# EAGLE design untitled (EAGLE 9.6.2)
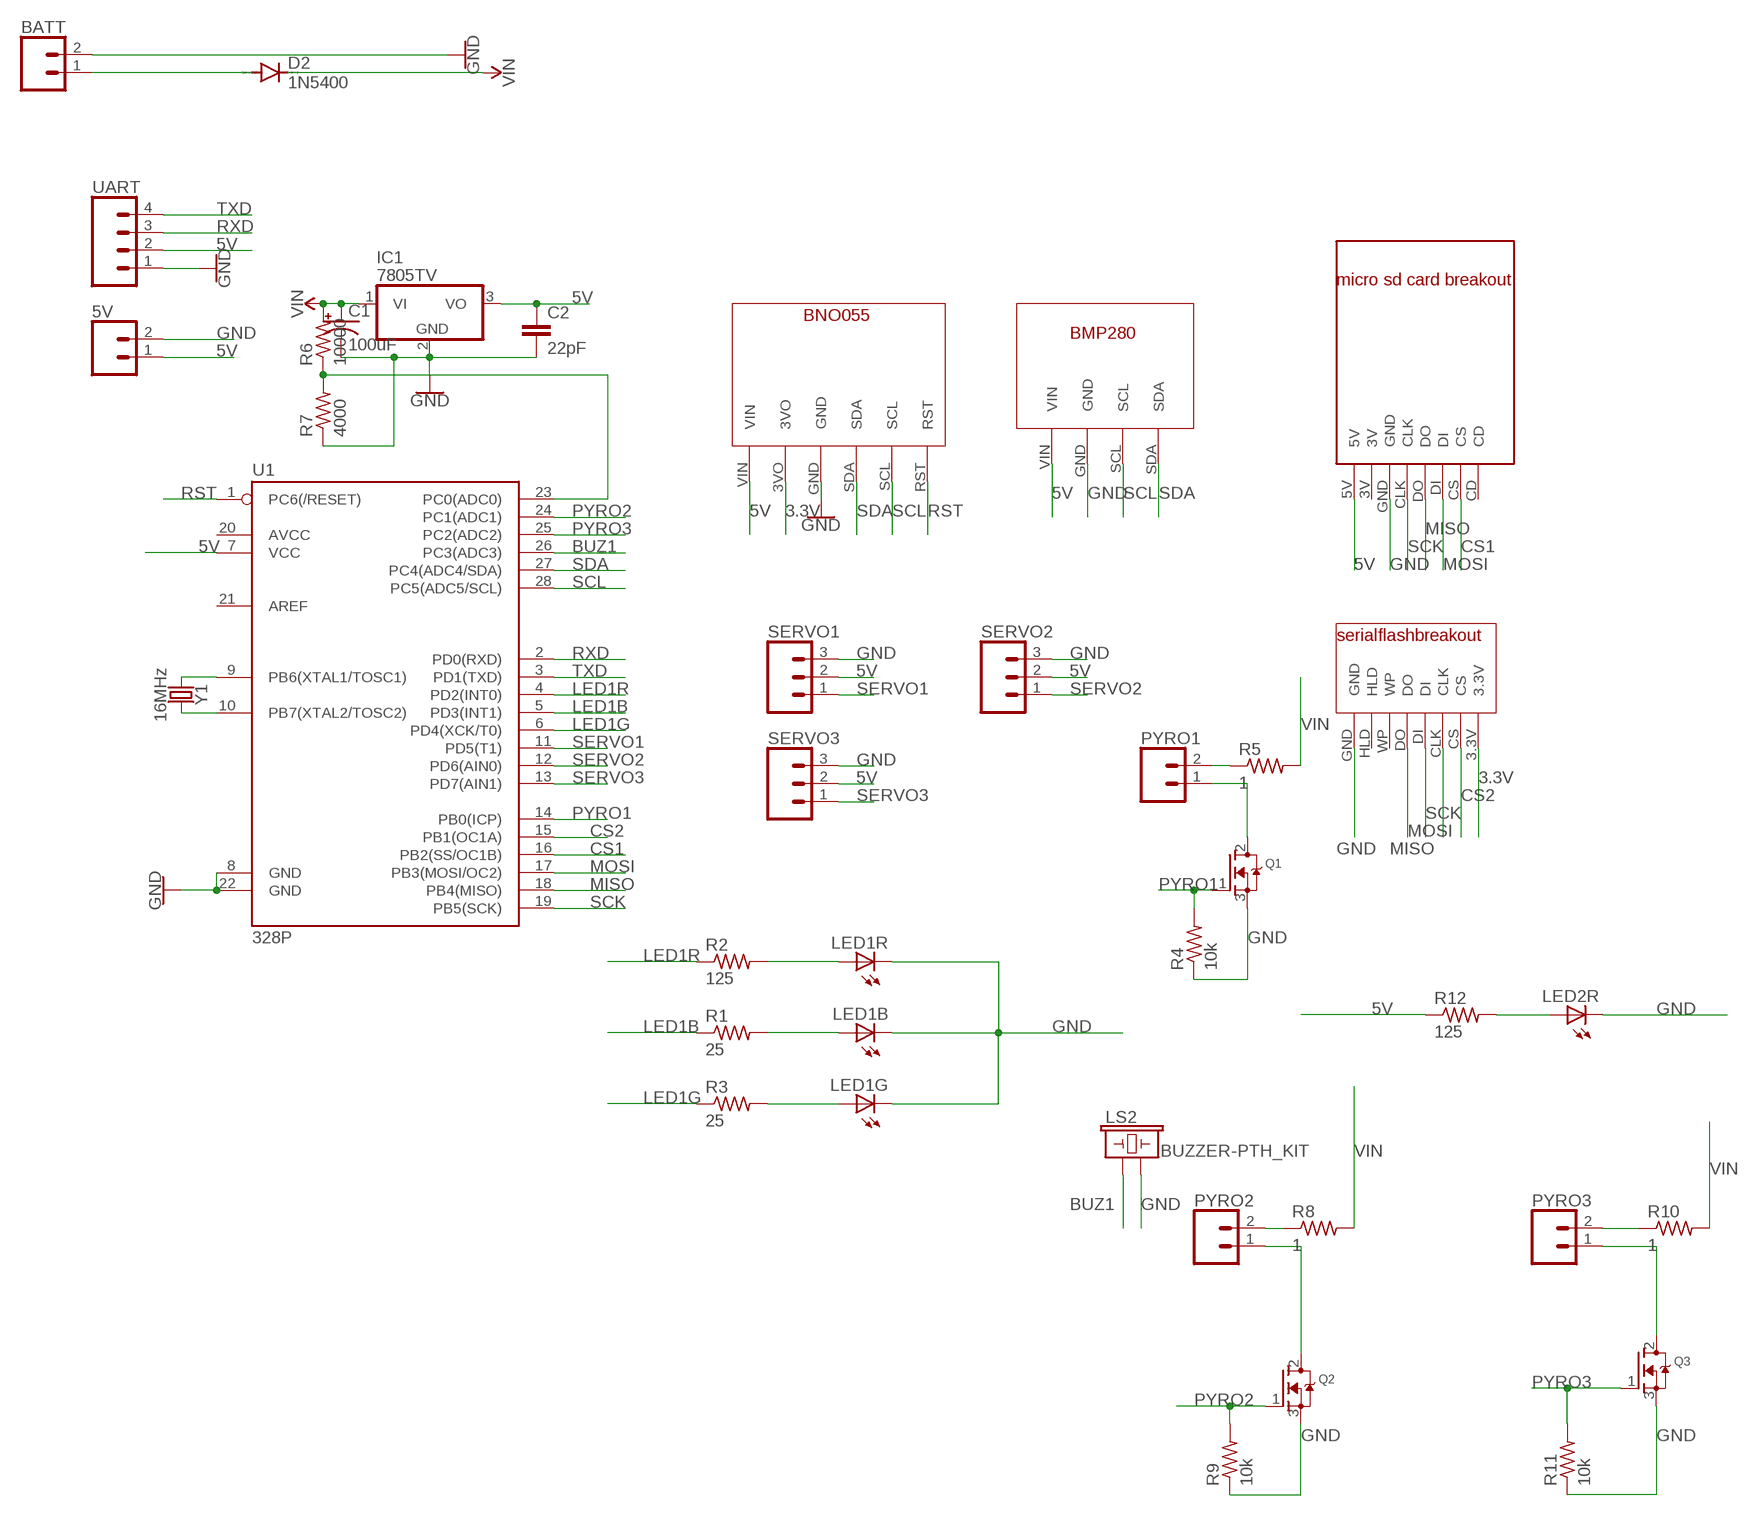
[diagram p0: schematic, sheet 1]

## Parts
5V  CONN_02  [1X02]
BATT  CONN_02  [1X02]
C1  100uF  100UF-POLAR-RADIAL-2.5MM-25V-20%  [CPOL-RADIAL-2.5MM-6.5MM]
C2  22pF  22PF-PTH-2.54MM-200V-5%  [CAP-PTH-2.54]
D2  1N5400  [DO201-15]
IC1  7805TV  [TO220V]
LED1B  LED1B  LED5MM  [LED5MM]
LED1G  LED1G  LED5MM  [LED5MM]
LED1R  LED1R  LED5MM  [LED5MM]
LED2R  LED1R  LED5MM  [LED5MM]
LS2  BUZZER-PTH_KIT  [BUZZER-12MM-KIT]
PYRO1  CONN_02  [1X02]
PYRO2  CONN_02  [1X02]
PYRO3  CONN_02  [1X02]
Q1  MOSFET-NGDS_TO220V  [TO220V]
Q2  MOSFET-NGDS_TO220V  [TO220V]
Q3  MOSFET-NGDS_TO220V  [TO220V]
R1  25  FLIPFLOP-RES  [0805-THM]
R2  125  FLIPFLOP-RES  [0805-THM]
R3  25  FLIPFLOP-RES  [0805-THM]
R4  10k  FLIPFLOP-RES  [0805-THM]
R5  1  FLIPFLOP-RES  [0805-THM]
R6  10000  FLIPFLOP-RES  [0805-THM]
R7  4000  FLIPFLOP-RES  [0805-THM]
R8  1  FLIPFLOP-RES  [0805-THM]
R9  10k  FLIPFLOP-RES  [0805-THM]
R10  1  FLIPFLOP-RES  [0805-THM]
R11  10k  FLIPFLOP-RES  [0805-THM]
R12  125  FLIPFLOP-RES  [0805-THM]
SERVO1  CONN_03  [1X03]
SERVO2  CONN_03  [1X03]
SERVO3  CONN_03  [1X03]
U1  328P  ATMEGA328P_PDIP  [DIP28]
U$1  BNO055  [BNO055]
U$2  BMP280  [BMP280]
U$3  ADAFRUITSDCARD  [ADAFRUITSDCARD]
U$4  SPARKFUNFLASHBREAKOUT  [SPARKFUNFLASHBREAKOUT]
UART  CONN_04PTH  [1X04]
Y1  16MHz  CRYSTAL-16MHZPTH-HC49US  [HC49US]

## Nets
3.3V: U$1.3VO U$4.3.3V
5V: 5V.1 C2.1 IC1.3(VO) R12.1 SERVO1.2 SERVO2.2 SERVO3.2 U1.7(VCC) U$1.VIN U$2.VIN U$3.5V UART.2
BUZ1: LS2.+ U1.26(PC3(ADC3))
CS1: U1.16(PB2(SS/OC1B)) U$3.CS
CS2: U1.15(PB1(OC1A)) U$4.CS
GND: 5V.2 BATT.2 C1.2(-) C2.2 IC1.2(GND) LED1B.K(C) LED1G.K(C) LED1R.K(C) LED2R.K(C) LS2.- Q1.3(S) Q2.3(S) Q3.3(S) R4.1 R7.1 R9.1 R11.1 SERVO1.3 SERVO2.3 SERVO3.3 U1.8(GND) U1.22(GND) U$1.GND U$2.GND U$3.GND U$4.GND UART.1
LED1B: R1.1 U1.5(PD3(INT1))
LED1G: R3.1 U1.6(PD4(XCK/T0))
LED1R: R2.1 U1.4(PD2(INT0))
MISO: U1.18(PB4(MISO)) U$3.DO U$4.DO
MOSI: U1.17(PB3(MOSI/OC2)) U$3.DI U$4.DI
N$1: PYRO1.1 Q1.2(D)
N$2: LED1R.A R2.2
N$3: LED1B.A R1.2
N$4: LED1G.A R3.2
N$5: PYRO1.2 R5.1
N$6: R6.1 R7.2 U1.23(PC0(ADC0))
N$7: U1.9(PB6(XTAL1/TOSC1)) Y1.1
N$8: U1.10(PB7(XTAL2/TOSC2)) Y1.2
N$9: BATT.1 D2.A
N$10: PYRO2.2 R8.1
N$11: PYRO3.2 R10.1
N$12: PYRO2.1 Q2.2(D)
N$13: PYRO3.1 Q3.2(D)
N$14: LED2R.A R12.2
PYRO1: Q1.1(G) R4.2 U1.14(PB0(ICP))
PYRO2: Q2.1(G) R9.2 U1.24(PC1(ADC1))
PYRO3: Q3.1(G) R11.2 U1.25(PC2(ADC2))
RST: U1.1(PC6(/RESET)) U$1.RST
RXD: U1.2(PD0(RXD)) UART.3
SCK: U1.19(PB5(SCK)) U$3.CLK U$4.CLK
SCL: U1.28(PC5(ADC5/SCL)) U$1.SCL U$2.SCL
SDA: U1.27(PC4(ADC4/SDA)) U$1.SDA U$2.SDA
SERVO1: SERVO1.1 U1.11(PD5(T1))
SERVO2: SERVO2.1 U1.12(PD6(AIN0))
SERVO3: SERVO3.1 U1.13(PD7(AIN1))
TXD: U1.3(PD1(TXD)) UART.4
VIN: C1.1(+) D2.C IC1.1(VI) R5.2 R6.2 R8.2 R10.2
Unconnected: U1.20(AVCC) U1.21(AREF) U$3.3V U$3.CD U$4.HLD U$4.WP

## Library data of the parts
5V BATT PYRO1-PYRO3 = SparkFun-Connectors:CONN_02: Multi connection point. Often used as Generic Header-pin footprint for 0.1 inch spaced/style header connections On any of the 0.1 inch spaced packages, you can populate with these: Break Away Headers - Straight <https://www.sparkfun.com/products/116> (PRT-00116) Break Away Male Headers - Right Angle <https://www.sparkfun.com/products/553> (PRT-00553) Female Headers <https://www.sparkfun.com/products/115> (PRT-00115) Break Away Headers - Machine Pin <https://www.sparkfun.com/products/117> (PRT-00117) Break Away Female Headers - Swiss Machine Pin <https://www.sparkfun.com/products/743> (PRT-00743) For SCREWTERMINALS and SPRING TERMINALS visit here: Screw Terimnals on SparkFun.com <https://www.sparkfun.com/search/results?term=Screw+Terminals> (5mm/3.5mm/2.54mm spacing) This device is also useful as a general connection point to wire up your design to another part of your project. Our various solder wires solder well into these plated through hole pads. Hook-Up Wire - Assortment (Stranded, 22 AWG) <https://www.sparkfun.com/products/11375> (PRT-11375) Hook-Up Wire - Assortment (Solid Core, 22 AWG) <https://www.sparkfun.com/products/11367> (PRT-11367) View the entire wire category on our website here <https://www.sparkfun.com/categories/141> Special notes: Molex polarized connector foot print use with: PRT-08233 with associated crimp pins and housings. 2.54_SCREWTERM for use with PRT-10571. 3.5mm Screw Terminal footprints for PRT-08084 5mm Screw Terminal footprints for use with PRT-08432
C1 = SparkFun-Capacitors:100UF-POLAR: 100µF polarized capacitors A capacitor is a passive two-terminal electrical component used to store electrical energy temporarily in an electric field.; PROD_ID: CAP-08439
C2 = SparkFun-Capacitors:22PF: 22pF ceramic capacitors A capacitor is a passive two-terminal electrical component used to store electrical energy temporarily in an electric field.; PROD_ID: CAP-09128
D2 = diode:1N5400: DIODE standard rectifier, 3 A, 50 V (Motorola)
IC1 = linear:78*: Positive VOLTAGE REGULATOR Source: http://cache.national.com/ds/LM/LM78L05.pdf http://www.fairchildsemi.com/ds/LM/LM7805.pdf
LED1B LED1G LED1R LED2R = adafruit:LED: LED OSRAM: - CHIPLED LG R971, LG N971, LY N971, LG Q971, LY Q971, LO R971, LY R971 LH N974, LH R974 LS Q976, LO Q976, LY Q976 LO Q996 - Hyper CHIPLED LW Q18S LB Q993, LB Q99A, LB R99A - SideLED LS A670, LO A670, LY A670, LG A670, LP A670 LB A673, LV A673, LT A673, LW A673 LH A674 LY A675 LS A676, LA A676, LO A676, LY A676, LW A676 LS A679, LY A679, LG A679 - Hyper Micro SIDELED® LS Y876, LA Y876, LO Y876, LY Y876 LT Y87S - SmartLED LW L88C, LW L88S LB L89C, LB L89S, LG L890 LS L89K, LO L89K, LY L89K LS L896, LA L896, LO L896, LY L896 - TOPLED LS T670, LO T670, LY T670, LG T670, LP T670 LSG T670, LSP T670, LSY T670, LOP T670, LYG T670 LG T671, LOG T671, LSG T671 LB T673, LV T673, LT T673, LW T673 LH T674 LS T676, LA T676, LO T676, LY T676, LB T676, LH T676, LSB T676, LW T676 LB T67C, LV T67C, LT T67C, LS T67K, LO T67K, LY T67K, LW E67C LS E67B, LA E67B, LO E67B, LY E67B, LB E67C, LV E67C, LT E67C LW T67C LS T679, LY T679, LG T679 LS T770, LO T770, LY T770, LG T770, LP T770 LB T773, LV T773, LT T773, LW T773 LH T774 LS E675, LA E675, LY E675, LS T675 LS T776, LA T776, LO T776, LY T776, LB T776 LHGB T686 LT T68C, LB T68C - Hyper Mini TOPLED® LB M676 - Mini TOPLED Santana® LG M470 LS M47K, LO M47K, LY M47K Source: http://www.osram.convergy.de/
LS2 = SparkFun-Electromechanical:BUZZER: Buzzer Small round buzzers that operate around the audible 2kHz range. You can use these as speakers to create simple music or user interfaces. Variant Overview: PTH - Mini Speaker - PC Mount 12mm 2.048kHz <https://www.sparkfun.com/products/7950> PTH_KIT - Mini Speaker - PC Mount 12mm 2.048kHz <https://www.sparkfun.com/products/7950> KIT simplifies soldering by adding stop mask to one side of the pads. PTH_NO_SILK - Mini Speaker - PC Mount 12mm 2.048kHz <https://www.sparkfun.com/products/7950> No silkscreen indicator of buzzer outline. PTH_KIT_NO_SILK - Mini Speaker - PC Mount 12mm 2.048kHz <https://www.sparkfun.com/products/7950> KIT package w/o silkscreen SMD - Buzzer Audio Magnetic (CCV-084B16) SMD buzzer used on, e.g. the LilyPad Buzzer <https://www.sparkfun.com/products/8463> and RFID USB Reader <https://www.sparkfun.com/products/9963>. SMD_KIT - Buzzer Audio Magnetic (CCV-084B16) SMD Buzzer with elongated pins to make soldering easier. Used on the SparkFun Simon Says - Surface Mount Soldering Kit <https://www.sparkfun.com/products/10935>. SMD-SQUARE - Buzzer Audio Magnetic (COMP-15701) SMT square buzzer with one chamfered corner.; PROD_ID: COMP-08253; SF_SKU: COM-07950
Q1-Q3 = adafruit:MOSFET-N: N-Channel Mosfet 2N7002E - 60V 260mA SOT23 [Digikey: 2N7002ET1GOSTR-ND] - REEL BSH103 - 30V 850mA SOT23 [Digikey: 568-5013-1-ND]
R1-R12 = adafruit:FLIPFLOP-RES: Flip Flop resistor An 0805 resistor inside a standard 1/4W 5% resistor. Makes for easy mods
SERVO1-SERVO3 = SparkFun-Connectors:CONN_03: Multi connection point. Often used as Generic Header-pin footprint for 0.1 inch spaced/style header connections On any of the 0.1 inch spaced packages, you can populate with these: Break Away Headers - Straight <https://www.sparkfun.com/products/116> (PRT-00116) Break Away Male Headers - Right Angle <https://www.sparkfun.com/products/553> (PRT-00553) Female Headers <https://www.sparkfun.com/products/115> (PRT-00115) Break Away Headers - Machine Pin <https://www.sparkfun.com/products/117> (PRT-00117) Break Away Female Headers - Swiss Machine Pin <https://www.sparkfun.com/products/743> (PRT-00743) Stackable Header - 3 Pin (Female, 0.1") <https://www.sparkfun.com/products/13875> (PRT-13875) For SCREWTERMINALS and SPRING TERMINALS visit here: Screw Terimnals on SparkFun.com <https://www.sparkfun.com/search/results?term=Screw+Terminals> (5mm/3.5mm/2.54mm spacing) This device is also useful as a general connection point to wire up your design to another part of your project. Our various solder wires solder well into these plated through hole pads. Hook-Up Wire - Assortment (Stranded, 22 AWG) <https://www.sparkfun.com/products/11375> (PRT-11375) Hook-Up Wire - Assortment (Solid Core, 22 AWG) <https://www.sparkfun.com/products/11367> (PRT-11367) View the entire wire category on our website here <https://www.sparkfun.com/categories/141> Special notes: Molex polarized connector foot print use with SKU : PRT-08232 with associated crimp pins and housings.
U1 = SparkFun-IC-Microcontroller:ATMEGA328P_PDIP: Atmel 328P Through hole ATMEGA328P uC used in the Arduino 32kb flash, 1k EEPROM, 2k SRAM Datasheet <http://www.sparkfun.com/datasheets/Components/SMD/ATMega328.pdf> SparkFun Products Storefront component: AVR 28 Pin 20MHz 32K 6A/D - ATMega328P <https://www.sparkfun.com/products/9061> (COM-09061) SparkFun Simon Says - Through-Hole Soldering Kit <https://www.sparkfun.com/products/10547> (KIT-10547) SparkFun Learn to Solder - Simon Says <https://www.sparkfun.com/products/13708> (KIT-13708) SparkFun BigTime Watch Kit <https://www.sparkfun.com/products/11734> (KIT-11734) SparkFun ClockIt <https://www.sparkfun.com/products/10930> (KIT-10930) SparkFun Serial Enabled LCD Kit <https://www.sparkfun.com/products/10097> (LCD-10097) SparkFun Simon Tilts - Through Hole Soldering Kit <https://www.sparkfun.com/products/12634> (KIT-12634) SparkFun Frequency Counter Kit <https://www.sparkfun.com/products/10140> (KIT-10140) FabFM Radio Kit <https://www.sparkfun.com/products/11043> (KIT-11043) SparkFun Binary Blaster Kit <https://www.sparkfun.com/products/12037> (KIT-12037) SparkFun Metro-Gnome <https://www.sparkfun.com/products/9236> (KIT-09236) ATmega328 with Arduino Optiboot (Uno) <https://www.sparkfun.com/products/10524> (DEV-10524); PROD_ID: IC-09136
U$1 = BNO055:BNO055
U$2 = bmp280:BMP280
U$3 = micro sd card breakout:ADAFRUITSDCARD
U$4 = SPARKFUNFLASHBREAKOUT:SPARKFUNFLASHBREAKOUT
UART = SparkFun-Connectors:CONN_04: Multi connection point. Often used as Generic Header-pin footprint for 0.1 inch spaced/style header connections On any of the 0.1 inch spaced packages, you can populate with these: Break Away Headers - Straight <https://www.sparkfun.com/products/116> (PRT-00116) Break Away Male Headers - Right Angle <https://www.sparkfun.com/products/553> (PRT-00553) Female Headers <https://www.sparkfun.com/products/115> (PRT-00115) Break Away Headers - Machine Pin <https://www.sparkfun.com/products/117> (PRT-00117) Break Away Female Headers - Swiss Machine Pin <https://www.sparkfun.com/products/743> (PRT-00743) For SCREWTERMINALS and SPRING TERMINALS visit here: Screw Terimnals on SparkFun.com <https://www.sparkfun.com/search/results?term=Screw+Terminals> (5mm/3.5mm/2.54mm spacing) This device is also useful as a general connection point to wire up your design to another part of your project. Our various solder wires solder well into these plated through hole pads. Hook-Up Wire - Assortment (Stranded, 22 AWG) <https://www.sparkfun.com/products/11375> (PRT-11375) Hook-Up Wire - Assortment (Solid Core, 22 AWG) <https://www.sparkfun.com/products/11367> (PRT-11367) View the entire wire category on our website here <https://www.sparkfun.com/categories/141> Special notes: Molex polarized connector foot print use with SKU : PRT-08231 with associated crimp pins and housings. 1MM SMD Version SKU: PRT-10208; PROD_ID: CONN-09696
Y1 = SparkFun-Clocks:CRYSTAL-16MHZ: 16MHz Crystal Digikey Example <http://www.digikey.com/product-search/en?keywords=535-9122-1-ND> Frequency: 16MHz Frequency Stability: ±50ppm Frequency Tolerance: ±20ppm Load Capacitance: 18pF SparkFun Products: Pro Micro -5V/16MHz <https://www.sparkfun.com/products/12640> SparkFun Serial Enabled LCD Kit <https://www.sparkfun.com/products/10097>; PROD_ID: XTAL-08181; SF_ID: COM-00536

## Net classes
0 default: width 0.75 mm

## Board
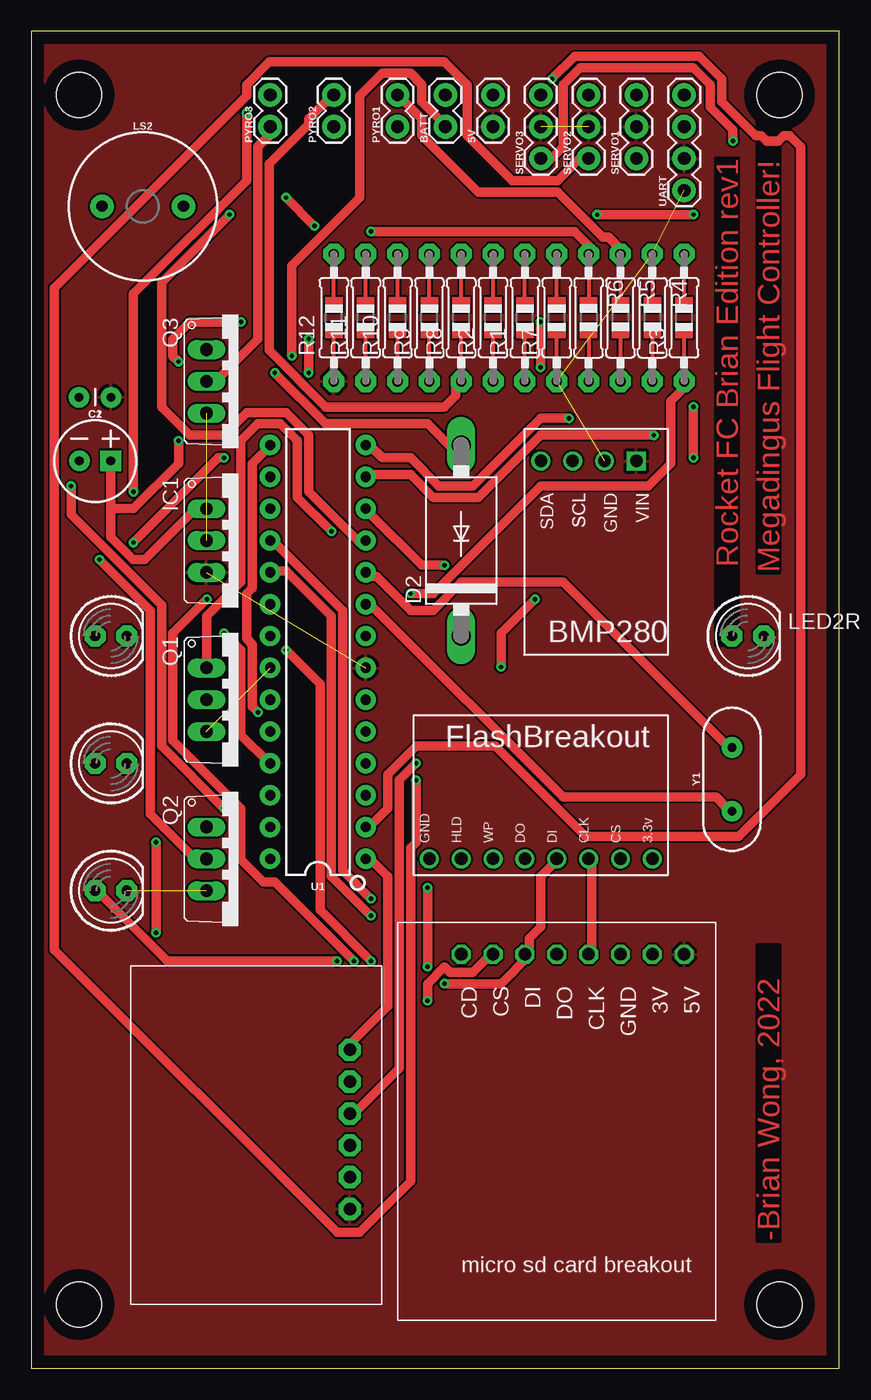
[diagram p1: board, top side]
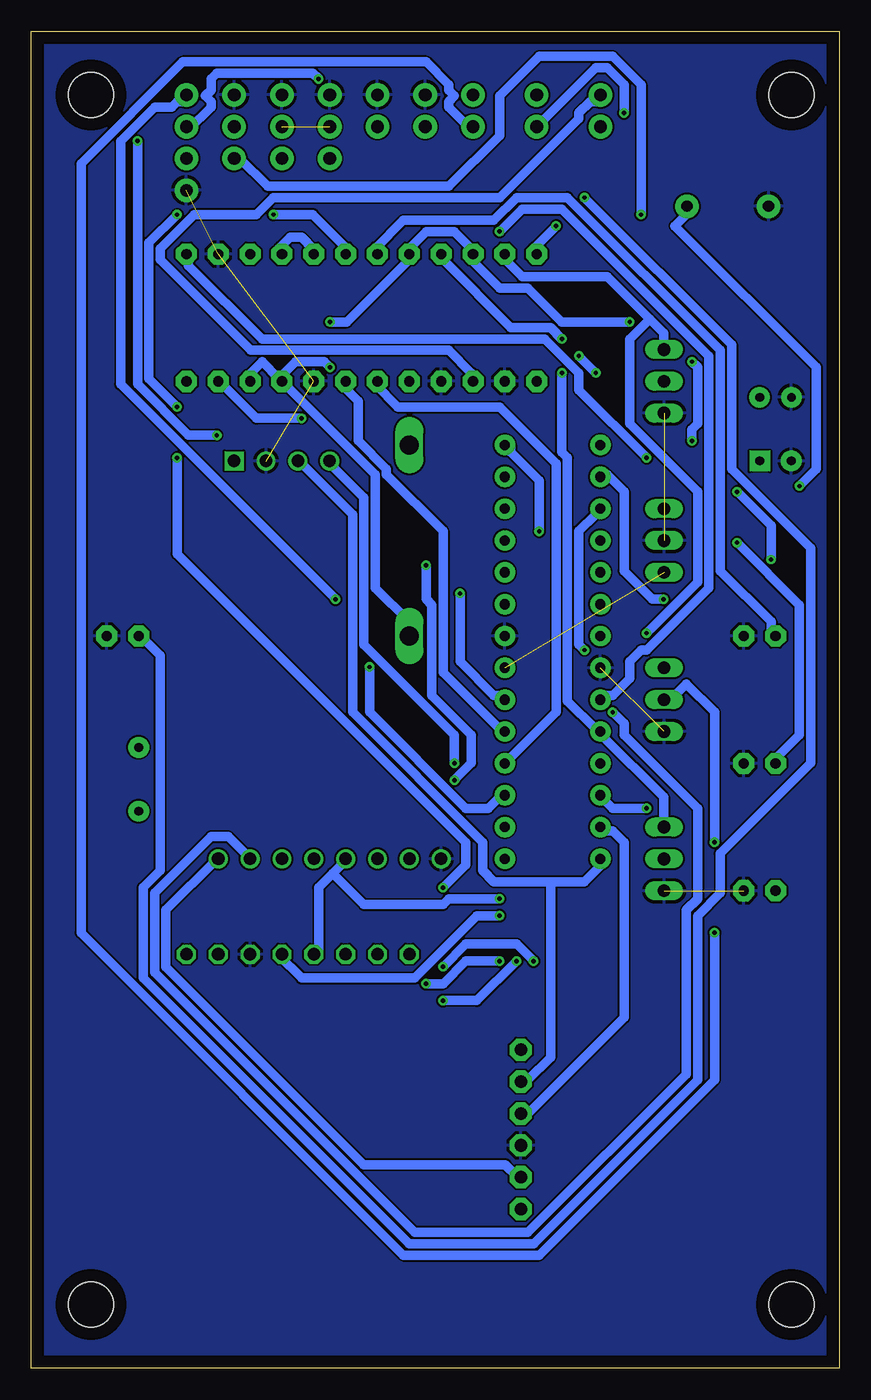
[diagram p2: board, bottom side, seen from below]

Size 64.44 x 106.67 mm. Coordinates in mm from the lower left corner, seen from the top.
Outline: 0,0 64.44,0 64.44,106.67 0,106.67 0,0
Copper layers (1*16): Top 0.035mm / dielectric 1.5mm / Bottom 0.035mm
Design rules "default": minimum track width 6mil, minimum drill 0.35mm, track to track 6mil, track to pad 6mil, pad to pad 6mil, via to via 6mil, smd to smd 6mil, copper to edge 40mil, drill to drill 6mil, minimum pad ring 10mil, minimum via ring 8mil, stop-mask expansion 4mil, vias tented up to drill 0mil, thermal gap 10mil
Holes 3.6 mm at 3.81,5.08 59.69,5.08 3.81,101.6 59.69,101.6

### Footprints (pad centres in the part's own frame; a part is rotated, then mirrored left to right if it is on the bottom)
1X02 = drill 1.016 pad 1.88: 1 0,0; 2 2.54,0
CPOL-RADIAL-2.5MM-6.5MM = drill 0.7 pad 1.651 square: 1 1.25,0 | drill 0.7 pad 1.651: 2 -1.25,0
CAP-PTH-2.54 = drill 0.7 pad 1.651: 1 -1.27,0; 2 1.27,0
DO201-15 = drill 1.499 long: A 7.62,0; C -7.62,0
TO220V = drill 1.016 long: 1 -2.54,-2.54; 2 0,-2.54; 3 2.54,-2.54
LED5MM = drill 0.813 pad 1.676 octagon: A -1.27,0; K 1.27,0
BUZZER-12MM-KIT = drill 0.9 pad 1.88: + 3.25,0; - -3.25,0
0805-THM = drill 0.813 pad 1.676 octagon: 1 -5.08,0; 2 5.08,0
1X03 = drill 1.016 pad 1.88: 1 0,0; 2 2.54,0; 3 5.08,0
DIP28 = drill 0.813 pad 1.626: 1 -16.51,-3.81; 2 -13.97,-3.81; 3 -11.43,-3.81; 4 -8.89,-3.81; 5 -6.35,-3.81; 6 -3.81,-3.81; 7 -1.27,-3.81; 8 1.27,-3.81; 9 3.81,-3.81; 10 6.35,-3.81; 11 8.89,-3.81; 12 11.43,-3.81; 13 13.97,-3.81; 14 16.51,-3.81; 15 16.51,3.81; 16 13.97,3.81; 17 11.43,3.81; 18 8.89,3.81; 19 6.35,3.81; 20 3.81,3.81; 21 1.27,3.81; 22 -1.27,3.81; 23 -3.81,3.81; 24 -6.35,3.81; 25 -8.89,3.81; 26 -11.43,3.81; 27 -13.97,3.81; 28 -16.51,3.81
BNO055 = drill 1 pad 1.778 octagon: 3VO 10.16,2.54; GND 12.7,2.54; RST 20.32,2.54; SCL 17.78,2.54; SDA 15.24,2.54; VIN 7.62,2.54
BMP280 = drill 1: GND 5.08,2.54; SCL 7.62,2.54; SDA 10.16,2.54 | drill 1 square: VIN 2.54,2.54
ADAFRUITSDCARD = drill 1 octagon: 3V 5.08,2.54; 5V 2.54,2.54; CD 20.32,2.54; CLK 10.16,2.54; CS 17.78,2.54; DI 15.24,2.54; DO 12.7,2.54; GND 7.62,2.54
SPARKFUNFLASHBREAKOUT = drill 1: 3.3V 19.05,1.27; CLK 13.97,1.27; CS 16.51,1.27; DI 11.43,1.27; DO 8.89,1.27; GND 1.27,1.27; HLD 3.81,1.27; WP 6.35,1.27
1X04 = drill 1.016 pad 1.88: 1 0,0; 2 2.54,0; 3 5.08,0; 4 7.62,0
HC49US = drill 0.7 pad 1.651: 1 -2.54,0; 2 2.54,0

### Placement (x,y rotation side)
5V  36.83,99.06 90 top
BATT  33.02,99.06 90 top
C1  5.08,72.39 0 top
C2  5.08,77.47 180 top
D2  34.29,66.04 90 top
IC1  16.51,66.04 270 top
LED1B  6.35,38.1 0 top
LED1G  6.35,48.26 0 top
LED1R  6.35,58.42 0 top
LED2R  57.15,58.42 0 top
LS2  8.89,92.71 0 top
PYRO1  29.21,99.06 90 top
PYRO2  24.13,99.06 90 top
PYRO3  19.05,99.06 90 top
Q1  16.51,53.34 270 top
Q2  16.51,40.64 270 top
Q3  16.51,78.74 270 top
R1  39.37,83.82 90 top
R2  36.83,83.82 90 top
R3  52.07,83.82 90 top
R4  49.53,83.82 270 top
R5  46.99,83.82 270 top
R6  44.45,83.82 270 top
R7  41.91,83.82 90 top
R8  34.29,83.82 90 top
R9  31.75,83.82 90 top
R10  29.21,83.82 90 top
R11  26.67,83.82 90 top
R12  24.13,83.82 90 top
SERVO1  48.26,96.52 90 top
SERVO2  44.45,96.52 90 top
SERVO3  40.64,96.52 90 top
U1  22.86,57.15 90 top
U$1  27.94,5.08 90 top
U$2  50.8,74.93 180 top
U$3  54.61,35.56 180 top
U$4  30.48,39.37 0 top
UART  52.07,93.98 90 top
Y1  55.88,46.99 90 top

### Tracks (layer width: path | path; a pad name or v marks a point on that pad's centre or on a via)
3.3V
  Bottom 0.75: U$4.3.3V 49.65,40.61 53.71,36.55 53.71,32.03 37.92,16.24 26.64,16.24 25.74,15.34 U$1.3VO
5V  (2 unrouted)
  pour Top: -34.29,111.76 -34.29,-5.08 -21.59,-17.78 69.85,-17.78 100.33,12.7 100.33,86.36 74.93,111.76
BUZ1  (via drill 0.35)
  Top 0.75: v15.36,44.67 10.39,49.63 10.39,60.91 3.18,68.13 v3.18,70.39
  Bottom 0.75: v15.36,44.67 18.06,44.67 18.97,45.57 U1.26 | v3.18,70.39 1.82,71.74 1.82,79.86 13.1,91.14 12.2,92.05 12.65,92.5 12.2,92.95 LS2.+
CS1  (via drill 0.35)
  Top 0.75: v31.6,29.33 31.6,30.68 32.95,32.03 33.41,31.58 35.21,31.58 36.56,32.94 U$3.CS | v25.74,32.49 19.42,38.8 18.52,38.8 16.71,40.61 16.71,44.67 11.3,50.08 11.3,58.66 v14,61.36
  Bottom 0.75: v31.6,29.33 28.89,29.33 v25.74,32.49 | v14,61.36 14.91,61.36 17.16,63.62 17.16,69.94 18.52,71.29 18.97,71.29 U1.16
CS2  (via drill 0.35)
  Top 0.75: v18.06,52.34 17.61,52.79 17.61,57.75 17.16,58.2 17.16,61.81 17.61,62.27 17.61,72.19 18.97,73.55 U1.15
  Bottom 0.75: v18.06,52.34 17.16,51.44 17.16,50.53 11.3,44.67 11.3,37.45 12.2,36.55 12.2,23.46 24.83,10.83 33.86,10.83 54.61,31.58 54.61,37.9 50.1,42.41 48.75,42.41 47.39,41.06 U$4.CS
GND  (6 unrouted)
  pour Bottom: -36.83,101.6 -36.83,-2.54 -24.13,-15.24 52.07,-15.24 128.27,60.96 77.47,111.76 -26.67,111.76
LED1B
  Bottom 0.75: U1.5 27.09,50.99 31.6,55.5 31.6,66.78 36.11,71.29 36.11,71.74 38.37,74 38.37,77.16 39.72,78.51 R1.1
LED1G  (via drill 0.35)
  Top 0.75: v30.25,61.81 32.05,61.81 40.62,70.39 49.2,70.39 51,72.19 51,77.16 52.36,78.51 R3.1
  Bottom 0.75: v30.25,61.81 30.25,56.4 27.54,53.69 27.09,53.69 U1.6
LED1R
  Bottom 0.75: U1.4 26.64,48.28 22.58,52.34 22.58,72.19 27.09,76.7 35.21,76.7 37.02,78.51 R2.1
MISO  (via drill 0.35)
  Top 0.75: v27.09,37.45 24.83,39.71 24.83,60.46 19.42,65.88 U1.18
  Bottom 0.75: 40.4,39.48 39.27,40.61 U$4.DO | 40.4,39.48 41.53,38.35 41.53,33.39 U$3.DO | v27.09,37.45 31.15,37.45 31.6,37 37.92,37 40.4,39.48
MOSI  (via drill 0.35)
  Top 0.75: U$4.DI 41.98,40.61 40.62,39.25 40.62,35.19 39.72,34.29 39.72,33.39 U$3.DI 39.72,32.94 37.47,30.68 v32.95,30.68 | v20.32,57.3 23.03,54.59 23.03,36.55 v27.09,32.49
  Bottom 0.75: v20.32,57.3 20.77,57.75 20.77,66.78 19.42,68.13 U1.17 | v27.09,32.49 29.8,32.49 31.6,30.68 v32.95,30.68
N$1  (via drill 0.35)
  Top 0.75: v9.94,34.74 v9.94,41.96
  Bottom 0.75: v9.94,41.96 9.94,52.34 12.2,54.59 13.1,53.69 13.55,53.69 Q1.2 | v9.94,34.74 9.94,23.01 23.93,9.02 34.76,9.02 60.48,34.74 60.48,96.11 52.36,104.23 32.95,104.23 31.15,102.42 31.15,101.97 30.7,101.52 31.15,101.07 31.15,100.62 29.34,98.81 PYRO1.1
N$2
  Bottom 0.75: LED1R.A 5.43,58.66 5.43,59.56 9.49,63.62 9.49,81.22 21.68,93.4 25.74,93.4 27.54,91.59 34.76,91.59 37.02,89.34 R2.2
N$3  (via drill 0.35)
  Top 0.75: v24.38,32.49 10.85,32.49 5.43,37.9 LED1B.A | v31.6,38.35 v31.6,32.03 | v52.81,76.7 v52.81,72.64 | v45.14,92.05 v52.81,92.05
  Bottom 0.75: v24.38,32.49 25.74,33.84 29.8,33.84 v31.6,32.03 | v31.6,38.35 29.8,40.16 29.8,41.96 52.81,64.97 v52.81,72.64 | v52.81,76.7 55.06,78.96 55.06,89.79 v52.81,92.05 | v45.14,92.05 41.98,92.05 39.27,89.34 R1.2
N$4  (via drill 0.35)
  Top 0.75: v8.14,65.88 14.91,72.64 v15.36,72.64
  Bottom 0.75: v8.14,65.88 3.18,60.91 3.18,50.53 4.98,48.73 4.98,48.28 LED1G.A | v15.36,72.64 20.77,78.06 20.77,79.41 23.48,82.12 46.04,82.12 51.91,87.98 51.91,88.89 R3.2
N$5
  Top 0.75: R5.1 46.94,89.34 46.04,90.24 45.59,90.24 41.98,93.85 35.66,93.85 31.15,98.36 31.15,99.72 29.8,101.07 29.34,101.07 28.89,101.52 PYRO1.2
N$6  (via drill 0.35)
  Top 0.75: v27.09,90.69 43.33,90.69 44.69,89.34 R6.1
  Bottom 0.75: v27.09,90.69 25.28,92.5 22.13,92.5 10.39,80.77 10.39,62.27 15.36,57.3 15.81,57.3 16.71,56.4 16.71,55.05 18.06,53.69 18.97,53.69 U1.23 | R7.2 41.98,89.34 42.88,90.24 43.78,90.24 44.69,89.34 R6.1
N$7
  Top 0.75: U1.9 27.09,60.91 42.43,45.57 54.61,45.57 55.52,44.67 Y1.1
N$8
  Top 0.75: U1.10 27.09,63.17 27.54,63.17 30.25,60.46 32.05,60.46 34.31,62.72 42.43,62.72 55.52,49.63 Y1.2
N$9  (via drill 0.35)
  Top 0.75: v20.77,80.77 20.77,87.98 26.19,93.4 26.19,101.52 27.99,103.33 30.25,103.33 31.15,102.42 31.15,101.07 32.95,99.26 BATT.1 | v19.42,79.41 23.48,75.35 31.6,75.35 33.86,73.09 34.31,73.55 D2.A
  Bottom 0.75: v19.42,79.41 v20.77,80.77
N$10
  Top 0.75: R8.1 33.86,78.51 33.86,77.61 32.95,76.7 23.48,76.7 18.97,81.22 18.97,96.11 22.13,99.26 22.13,99.72 23.48,101.07 23.93,101.07 24.38,101.52 PYRO2.2
N$11
  Bottom 0.75: R10.1 29.34,78.96 29.34,79.41 31.15,81.22 46.94,81.22 54.16,88.44 54.16,89.34 51.45,92.05 46.49,92.05 45.14,93.4 27.09,93.4 20.77,99.72 20.77,100.17 19.87,101.07 18.97,101.07 18.97,101.52 PYRO3.2
N$12  (via drill 0.35)
  Top 0.75: v5.43,64.52 9.49,60.46 9.49,44.22 13.1,40.61 13.55,40.61 Q2.2 | v8.14,69.94 8.14,85.73 17.16,94.75 v17.16,100.17
  Bottom 0.75: v5.43,64.52 5.43,67.23 v8.14,69.94 | v17.16,100.17 17.16,102.42 18.52,103.78 19.42,103.78 23.93,99.26 PYRO2.1
N$13
  Top 0.75: Q3.2 14,78.96 14.91,78.96 18.06,82.12 18.06,97.46 18.97,98.36 18.52,98.81 18.97,99.26 PYRO3.1
N$14  (via drill 0.35)
  Top 0.75: v22.58,91.14 v20.32,93.4
  Bottom 0.75: v20.32,93.4 8.59,81.67 8.59,71.74 2.27,65.42 2.27,48.28 9.49,41.06 9.49,37.9 11.3,36.1 11.3,23.01 24.38,9.93 34.31,9.93 55.52,31.13 55.52,38.35 54.16,39.71 54.16,56.85 55.52,58.2 LED2R.A | v22.58,91.14 24.38,89.34 R12.2
PYRO1  (via drill 0.35)
  Top 0.75: v23.93,66.78 21.22,69.48 21.22,74 19.87,75.35 18.06,75.35 16.71,74 16.71,62.72 14,60.01 14,55.95 Q1.1 | v42.88,75.8 40.62,75.8 35.21,70.39 32.5,70.39 30.25,72.64 27.99,72.64 27.09,73.55 U1.14
  Bottom 0.75: v23.93,66.78 23.93,70.84 26.19,73.09 26.19,73.55 26.64,74 U1.14 | v42.88,75.8 46.49,75.8 49.2,78.51 R4.2
PYRO2  (via drill 0.35)
  Top 0.75: v22.13,79.41 v22.13,82.12
  Bottom 0.75: Q2.1 14,43.31 14,45.57 18.97,50.53 U1.24 19.42,50.99 21.68,53.24 21.68,72.64 22.13,73.09 v22.13,79.41 | v22.13,82.12 23.03,83.02 26.19,83.02 31.6,88.44 31.6,88.89 R9.2
PYRO3  (via drill 0.35)
  Top 0.75: v15.36,58.66 16.71,57.3 16.71,50.53 18.97,48.28 U1.25
  Bottom 0.75: 15.13,83.7 18.52,87.08 25.28,87.08 27.09,88.89 R11.2 | 15.13,83.7 14,82.57 14,81.67 Q3.1 | v15.36,58.66 11.3,62.72 11.3,69.94 16.71,75.35 16.71,82.12 15.13,83.7
RST
  Top 0.75: U1.1 27.09,40.61 28.44,39.25 28.44,28.88 25.28,25.72 U$1.RST
RXD  (via drill 0.35)
  Top 0.75: v41.53,102.87 43.33,104.68 53.26,104.68 55.06,102.87 55.06,101.07 57.77,98.36 58.22,98.36 58.67,97.91 59.58,97.91 60.03,98.36 60.48,98.36 61.38,97.46 61.38,47.38 56.42,42.41 44.23,42.41 37.02,49.63 30.7,49.63 28.44,47.38 28.44,44.67 27.09,43.31 U1.2
  Bottom 0.75: v41.53,102.87 41.98,103.33 49.65,103.33 50.1,102.87 50.1,101.97 50.55,101.52 50.1,101.07 50.1,100.62 51.91,98.81 UART.3
SCK  (via drill 0.35)
  Top 0.75: U$3.CLK 44.69,33.39 44.69,40.61 U$4.CLK | v27.09,36.1 23.93,39.25 23.93,60.01 20.32,63.62 19.42,63.62 U1.19
  Bottom 0.75: v27.09,36.1 28.89,36.1 33.86,31.13 42.88,31.13 44.69,32.94 U$3.CLK
SCL
  Bottom 0.75: 23.03,38.8 20.32,38.8 18.97,40.16 18.97,40.61 U1.28 | 23.03,38.8 27.54,38.8 28.44,39.71 28.44,41.96 38.82,52.34 38.82,68.13 42.88,72.19 U$2.SCL | 23.03,38.8 23.03,24.82 24.83,23.01 25.28,23.01 U$1.SCL
SDA  (via drill 0.35)
  Top 0.75: v30.7,48.28 29.34,46.92 29.34,23.91 25.74,20.3 U$1.SDA
  Bottom 0.75: v30.7,48.28 30.7,50.53 37.92,57.75 37.92,69.48 40.62,72.19 U$2.SDA | U1.27 18.97,42.86 18.06,42.86 17.16,41.96 17.16,27.97 25.28,19.85 25.74,20.3 U$1.SDA
SERVO1  (via drill 0.35)
  Top 0.75: v15.81,92.05 10.39,86.63 10.39,76.7 12.65,74.45 15.36,74.45 17.16,76.25 20.32,76.25 22.13,74.45 22.13,69.94 26.19,65.88 26.64,65.88 U1.11
  Bottom 0.75: v15.81,92.05 15.81,102.42 18.06,104.68 23.93,104.68 27.09,101.52 27.09,98.36 31.15,94.3 45.59,94.3 47.84,96.56 SERVO1.1
SERVO2  (via drill 0.35)
  Top 0.75: v32.95,64.07 31.15,64.07 27.09,68.13 U1.12 | v30.7,46.92 30.7,41.96 30.25,41.51 30.25,14.89 26.19,10.83 24.38,10.83 1.82,33.39 1.82,86.18 17.16,101.52 17.16,102.42 18.97,104.23 32.95,104.23 34.76,102.42 34.76,98.36 38.37,94.75 41.98,94.75 44.23,97.01 44.69,96.56 SERVO2.1
  Bottom 0.75: v32.95,64.07 32.95,61.36 32.5,60.91 32.5,53.69 29.34,50.53 29.34,48.28 v30.7,46.92
SERVO3  (via drill 0.35)
  Top 0.75: v49.65,74.45 40.62,74.45 35.66,69.48 32.05,69.48 30.25,71.29 27.09,71.29 U1.13 | v55.97,97.91 55.97,98.81 54.16,100.62 54.16,102.42 52.81,103.78 43.78,103.78 42.43,102.42 42.43,97.46 41.08,96.11 SERVO3.1
  Bottom 0.75: v49.65,74.45 51.91,74.45 55.97,78.51 v55.97,97.91
TXD  (via drill 0.35)
  Top 0.75: v37.47,55.95 37.47,58.66 v40.17,61.36
  Bottom 0.75: v37.47,55.95 37.47,52.34 29.8,44.67 27.99,44.67 27.09,45.57 U1.3 | v40.17,61.36 57.32,78.51 57.32,97.91 54.61,100.62 53.26,100.62 52.81,101.07 51.91,101.07 51.91,101.52 UART.4
VIN  (via drill 0.35)
  Top 0.75: 6.33,68.58 6.33,72.19 C1.1 | 6.33,68.58 6.33,66.33 8.14,64.52 9.04,64.52 13.1,68.58 13.55,68.58 IC1.1 | v40.62,79.86 v40.62,83.47 | 6.33,68.58 8.14,68.58 11.75,72.19 v11.75,74 | v11.75,80.31 11.3,80.77 11.3,82.12 12.65,83.47 v16.71,83.47
  Bottom 0.75: 44.69,78.96 46.04,80.31 47.39,78.96 R5.2 | D2.C 34.31,58.66 34.31,59.56 37.02,62.27 37.02,71.29 44.23,78.51 R6.2 44.69,78.96 | v40.62,83.47 39.27,83.47 34.31,88.44 34.31,88.89 R8.2 34.31,89.34 32.95,90.69 30.7,90.69 29.34,89.34 R10.2 29.34,88.89 29.34,88.44 27.09,86.18 24.83,86.18 22.13,83.47 v16.71,83.47 | v40.62,79.86 41.08,80.31 43.33,80.31 44.69,78.96 | v11.75,74 11.75,74.9 11.3,75.35 11.3,79.86 v11.75,80.31

### Text on the board
Top: Rocket FC Brian Edition rev1 | Megadingus Flight Controller! | -Brian Wong, 2022